# EAGLE design s2kMeterTransposer (EAGLE 6.6.0)
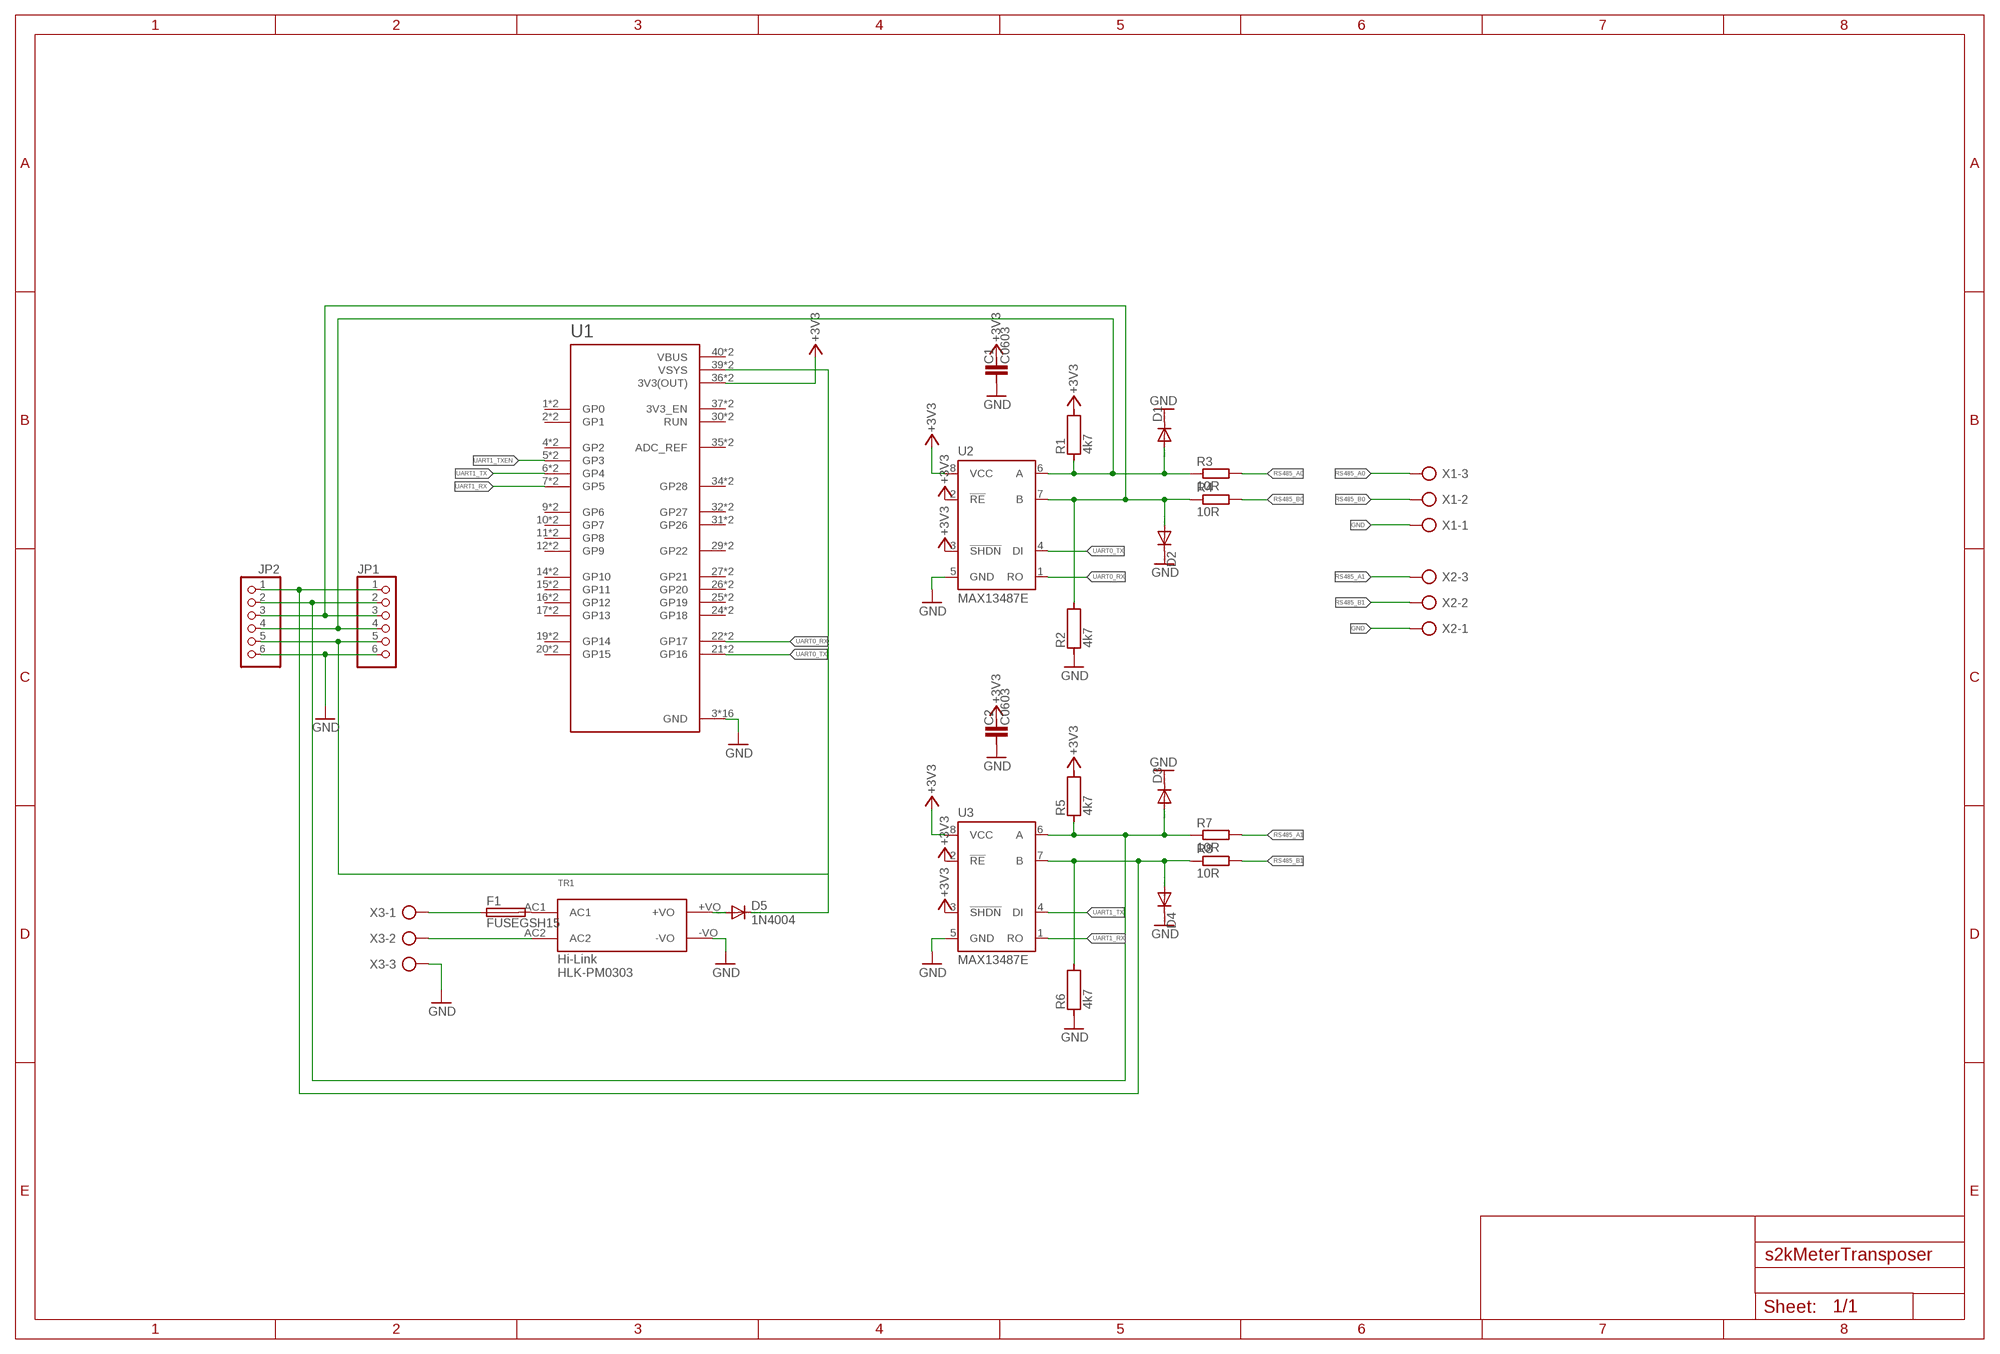
[diagram p0: schematic, sheet 1]

## Parts
C1  C0603  [C0603]
C2  C0603  [C0603]
D1  DIODE-DO-214AC  [DO-214AC]
D2  DIODE-DO-214AC  [DO-214AC]
D3  DIODE-DO-214AC  [DO-214AC]
D4  DIODE-DO-214AC  [DO-214AC]
D5  1N4004  [DO41-10]
F1  FUSEGSH15  [GSH15]
JP1  PINHD-1X6  [1X06]
JP2  PINHD-1X6/90  [1X06/90]
R1  4k7  R0603  [R0603]
R2  4k7  R0603  [R0603]
R3  10R  R-EU_R2010  [R2010]
R4  10R  R-EU_R2010  [R2010]
R5  4k7  R0603  [R0603]
R6  4k7  R0603  [R0603]
R7  10R  R-EU_R2010  [R2010]
R8  10R  R-EU_R2010  [R2010]
TR1  HYX2018013001158  [HYX2018013001158]
U1  RASPBERRY_PICO-NO_DEBUG  [PICO-PKG-NO_DEBUG]
U2  MAX13487E  [SO08]
U3  MAX13487E  [SO08]
X1  AK500/3  [AK500/3]
X2  AK500/3  [AK500/3]
X3  AK500/3  [AK500/3]

## Nets
+3V3: C1.2 C2.2 R1.2 R5.2 U1.36(3V3(OUT)) U1.P$36(3V3(OUT)) U2.2(!RE) U2.3(!SHDN) U2.8(VCC) U3.2(!RE) U3.3(!SHDN) U3.8(VCC)
GND: C1.1 C2.1 D1.C D2.C D3.C D4.C JP1.6 JP2.6 R2.1 R6.1 TR1.-VO U1.3(GND) U1.8(GND) U1.13(GND) U1.18(GND) U1.23(GND) U1.28(GND) U1.33(GND) U1.38(GND) U1.P$3(GND) U1.P$8(GND) U1.P$13(GND) U1.P$18(GND) U1.P$23(GND) U1.P$28(GND) U1.P$33(GND) U1.P$38(GND) U2.5(GND) U3.5(GND) X1.1 X2.1 X3.3
N$1: D2.A JP1.3 JP2.3 R2.2 R4.1 U2.7(B)
N$2: D1.A JP1.4 JP2.4 R1.1 R3.1 U2.6(A)
N$3: D4.A JP1.1 JP2.1 R6.2 R8.1 U3.7(B)
N$4: D3.A JP1.2 JP2.2 R5.1 R7.1 U3.6(A)
N$5: F1.2 TR1.AC1
N$6: F1.1 X3.1
N$7: TR1.AC2 X3.2
N$8: D5.A TR1.+VO
N$9: D5.C JP1.5 JP2.5 U1.39(VSYS) U1.P$39(VSYS)
RS485_A0: R3.2 X1.3
RS485_A1: R7.2 X2.3
RS485_B0: R4.2 X1.2
RS485_B1: R8.2 X2.2
UART0_RX: U1.22(GP17) U1.P$22(GP17) U2.1(RO)
UART0_TX: U1.21(GP16) U1.P$21(GP16) U2.4(DI)
UART1_RX: U1.7(GP5) U1.P$7(GP5) U3.1(RO)
UART1_TX: U1.6(GP4) U1.P$6(GP4) U3.4(DI)
UART1_TXEN: U1.5(GP3) U1.P$5(GP3)
Unconnected: U1.1(GP0) U1.2(GP1) U1.4(GP2) U1.9(GP6) U1.10(GP7) U1.11(GP8) U1.12(GP9) U1.14(GP10) U1.15(GP11) U1.16(GP12) U1.17(GP13) U1.19(GP14) U1.20(GP15) U1.24(GP18) U1.25(GP19) U1.26(GP20) U1.27(GP21) U1.29(GP22) U1.30(RUN) U1.31(GP26) U1.32(GP27) U1.34(GP28) U1.35(ADC_REF) U1.37(3V3_EN) U1.P$1(GP0) U1.P$2(GP1) U1.P$4(GP2) U1.P$9(GP6) U1.P$10(GP7) U1.P$11(GP8) U1.P$12(GP9) U1.P$14(GP10) U1.P$15(GP11) U1.P$16(GP12) U1.P$17(GP13) U1.P$19(GP14) U1.P$20(GP15) U1.P$24(GP18) U1.P$25(GP19) U1.P$26(GP20) U1.P$27(GP21) U1.P$29(GP22) U1.P$30(RUN) U1.P$31(GP26) U1.P$32(GP27) U1.P$34(GP28) U1.P$35(ADC_REF) U1.P$37(3V3_EN)

## Notes on the sheet
- Hi-Link 
  HLK-PM0303

## Power pins joined to a net without a drawn wire
VBUS: U1.40(VBUS) U1.P$40(VBUS)

## Library data of the parts
C1 C2 = KaiLib:C
D1-D4 = diode:DIODE-: DIODE
D5 = diode:1N4004: DIODE general purpose rectifier, 1 A
F1 = fuse:FUSE: Fuse; OC_FARNELL: unknown; OC_NEWARK: unknown
JP1 JP2 = pinhead:PINHD-1X6: PIN HEADER
R1 R2 R5 R6 = KaiLib:R
R3 R4 R7 R8 = rcl:R-EU_: RESISTOR, European symbol
TR1 = KaiLib:HYX2018013001158
U1 = RpiPico:RASPBERRY_PICO-NO_DEBUG
U2 U3 = MAX13487E:MAX13487E: Check availability <https://pricing.snapeda.com/parts/MAX13487E/Maxim%20Integrated/view-part?ref=eda>; AVAILABILITY: In Stock; DESCRIPTION: MAX13487E Digital Cable Driver Interface Evaluation Board; MF: Maxim Integrated; MP: MAX13487E; PACKAGE: SOIC-8 Maxim; PRICE: None; PURCHASE-URL: https://pricing.snapeda.com/search/part/MAX13487E/?ref=eda
X1-X3 = con-ptr500:AK500/3: CONNECTOR; OC_FARNELL: unknown; OC_NEWARK: unknown

## Board
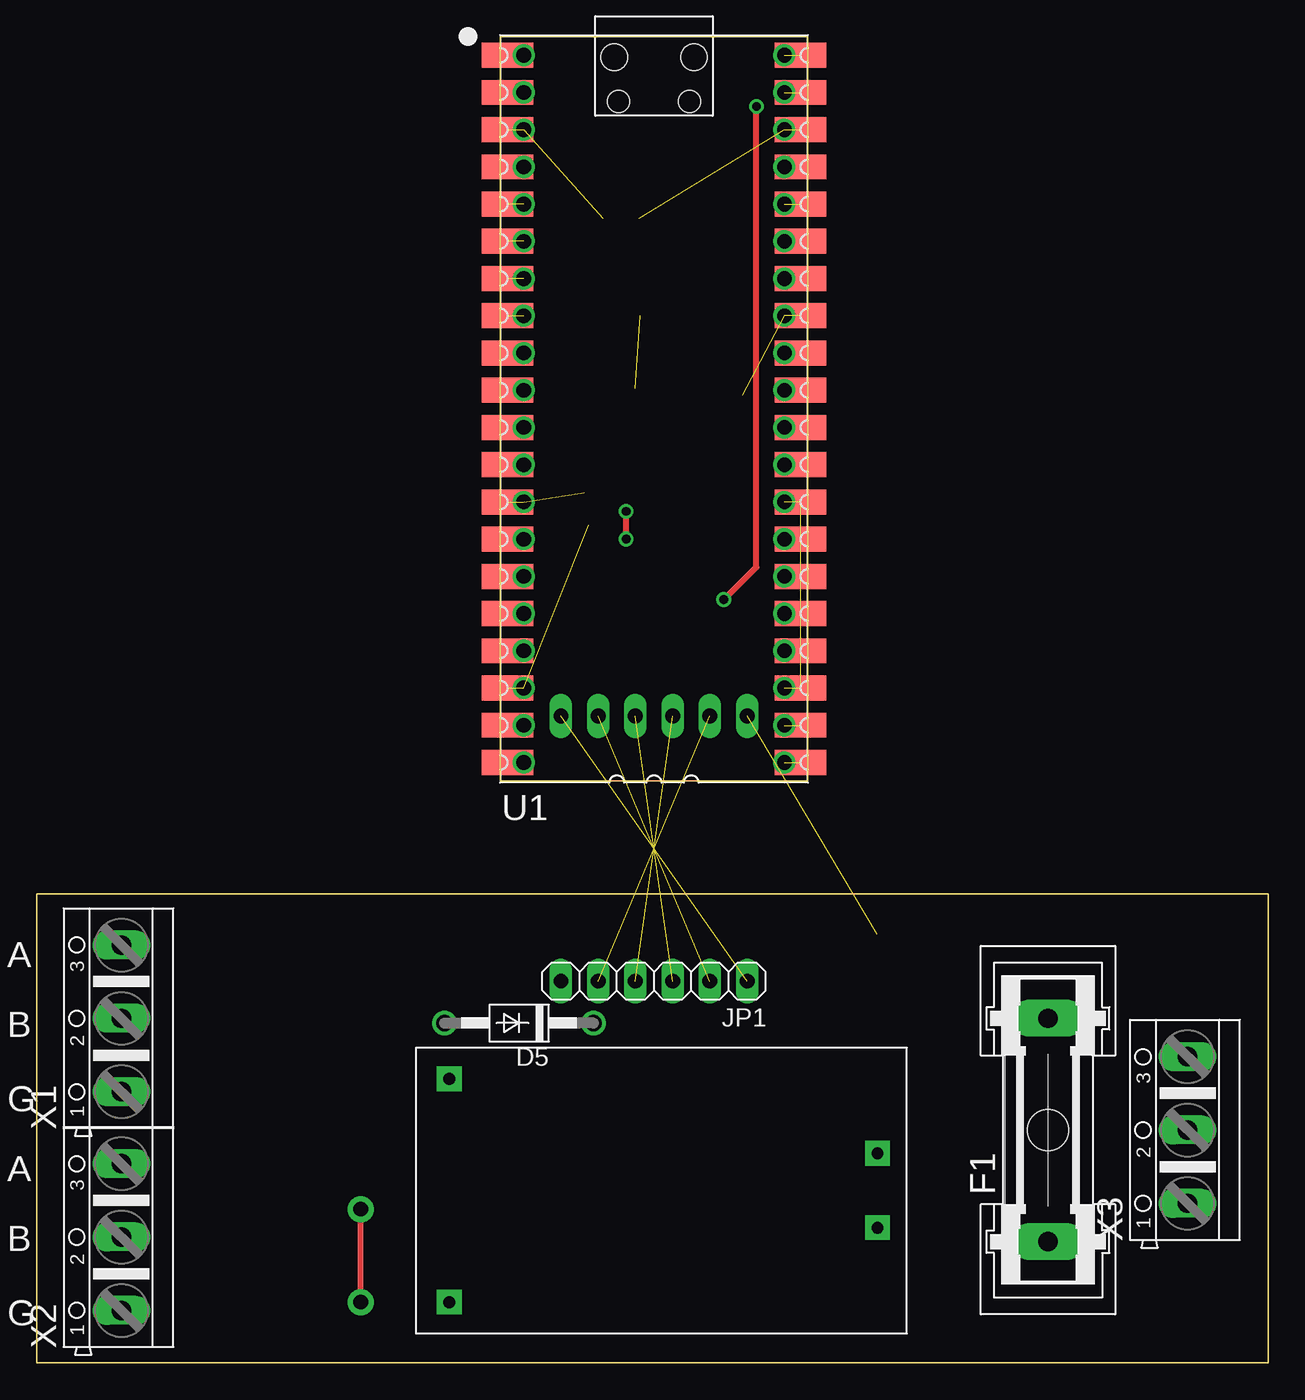
[diagram p1: board, top side]
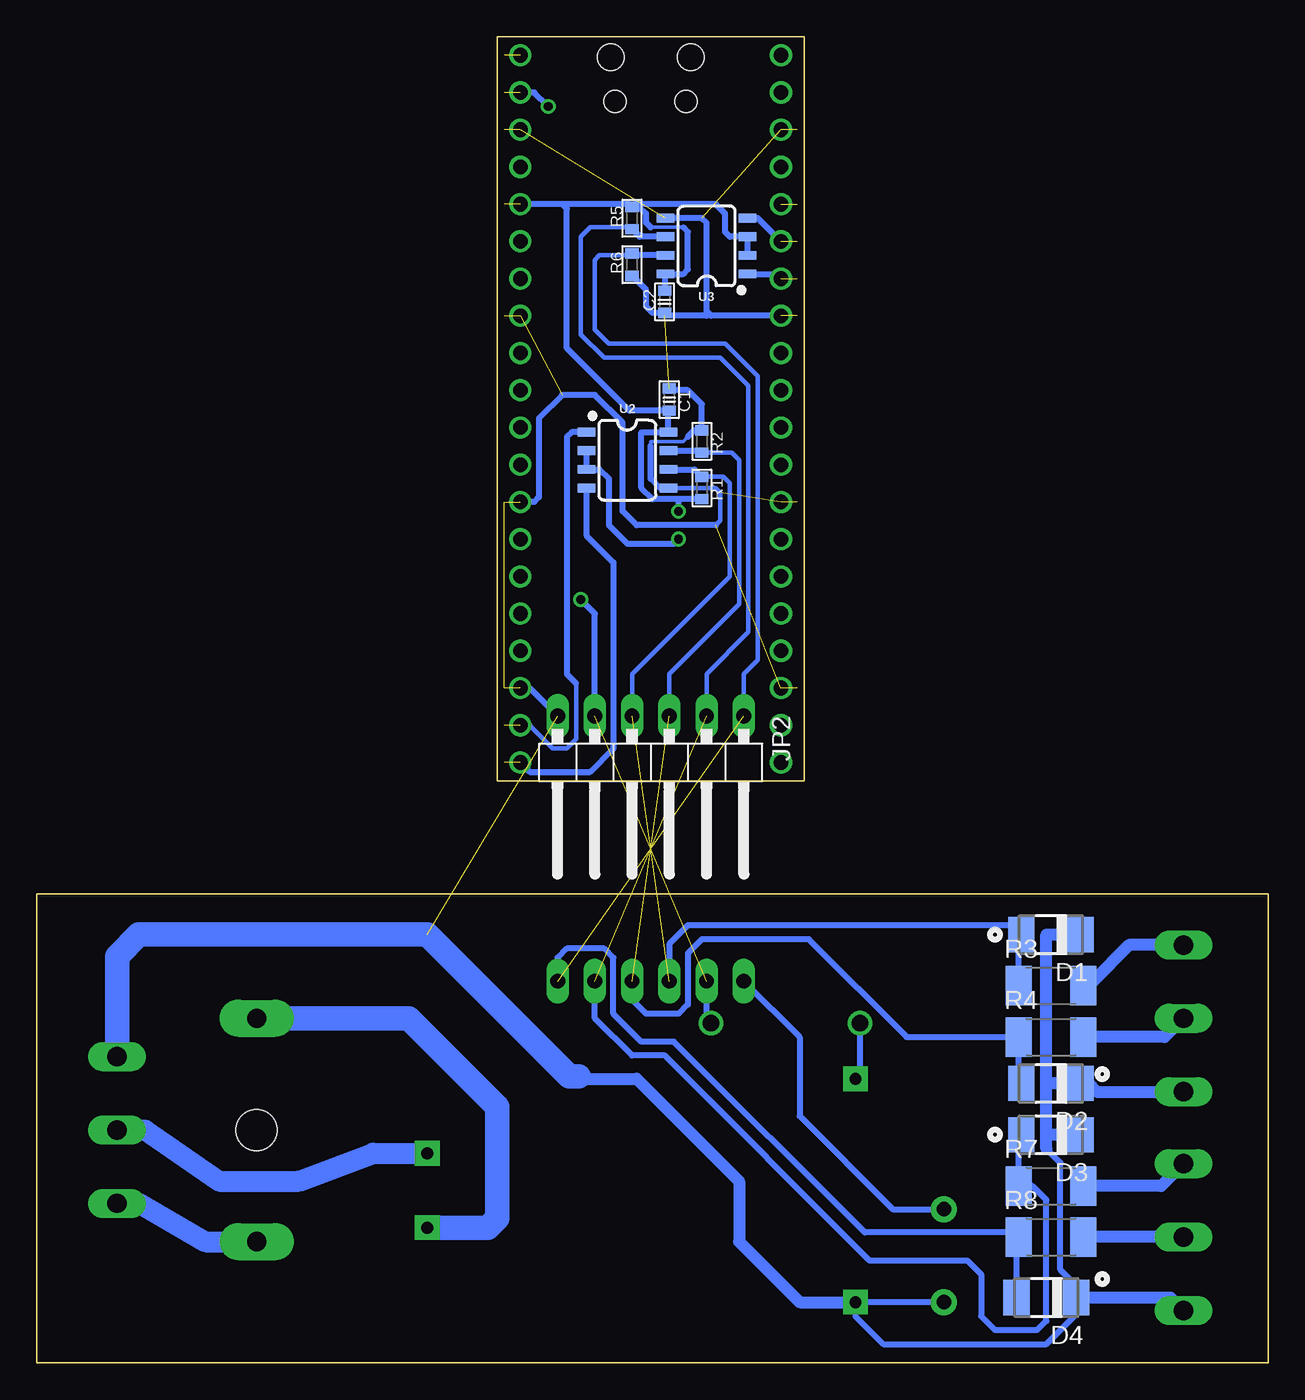
[diagram p2: board, bottom side, seen from below]

Size 84 x 90.5 mm. Coordinates in mm from the lower left corner, seen from the top.
Outline: 0,0 0,32 84,32 84,0 0,0
Outline: 31.64,39.7 52.59,39.7 52.59,90.5 31.64,90.5 31.64,39.7
Copper layers (1*16): Top 0.035mm / dielectric 1.5mm / Bottom 0.035mm
Design rules "default": minimum track width 10mil, minimum drill 24mil, track to track 8mil, track to pad 8mil, pad to pad 8mil, via to via 8mil, smd to smd 8mil, copper to edge 40mil, drill to drill 8mil, minimum pad ring 10mil, minimum via ring 8mil, stop-mask expansion 4mil, vias tented up to drill 0mil, thermal gap 10mil

### Footprints (pad centres in the part's own frame; a part is rotated, then mirrored left to right if it is on the bottom)
C0603 = smd 0.7 x 0.9: 1 -0.762,0; 2 0.762,0
DO-214AC = smd 1.8 x 2.4: A 2.025,0; C -2.025,0
DO41-10 = drill 1.118: A 5.08,0; C -5.08,0
GSH15 = drill 1.321 pad 2.54 long: 1 -7.62,0; 2 7.62,0 | hole 2.794: 0,0
1X06 = drill 1.016 long: 1 -6.35,0; 2 -3.81,0; 3 -1.27,0; 4 1.27,0; 5 3.81,0; 6 6.35,0
1X06/90 = drill 1.016 long: 1 -6.35,-3.81; 2 -3.81,-3.81; 3 -1.27,-3.81; 4 1.27,-3.81; 5 3.81,-3.81; 6 6.35,-3.81
R0603 = smd 0.7 x 0.9: 1 -0.762,0; 2 0.762,0
R2010 = smd 1.8 x 2.7: 1 -2.2,0; 2 2.2,0
HYX2018013001158 = drill 0.8 pad 1.676 square: +VO 13.97,-7.62; -VO 13.97,7.62; AC1 -15.24,2.54; AC2 -15.24,-2.54
PICO-PKG-NO_DEBUG = drill 1: 1 -7.62,25.4; 2 -7.62,22.86; 3 -7.62,20.32; 4 -7.62,17.78; 5 -7.62,15.24; 6 -7.62,12.7; 7 -7.62,10.16; 8 -7.62,7.62; 9 -7.62,5.08; 10 -7.62,2.54; 11 -7.62,0; 12 -7.62,-2.54; 13 -7.62,-5.08; 14 -7.62,-7.62; 15 -7.62,-10.16; 16 -7.62,-12.7; 17 -7.62,-15.24; 18 -7.62,-17.78; 19 -7.62,-20.32; 20 -7.62,-22.86; 21 10.16,-22.86; 22 10.16,-20.32; 23 10.16,-17.78; 24 10.16,-15.24; 25 10.16,-12.7; 26 10.16,-10.16; 27 10.16,-7.62; 28 10.16,-5.08; 29 10.16,-2.54; 30 10.16,0; 31 10.16,2.54; 32 10.16,5.08; 33 10.16,7.62; 34 10.16,10.16; 35 10.16,12.7; 36 10.16,15.24; 37 10.16,17.78; 38 10.16,20.32; 39 10.16,22.86; 40 10.16,25.4 | smd 3.5 x 1.7: P$1 -8.73,25.4; P$2 -8.73,22.86; P$3 -8.73,20.32; P$4 -8.73,17.78; P$5 -8.73,15.24; P$6 -8.73,12.7; P$7 -8.73,10.16; P$8 -8.73,7.62; P$9 -8.73,5.08; P$10 -8.73,2.54; P$11 -8.73,0; P$12 -8.73,-2.54; P$13 -8.73,-5.08; P$14 -8.73,-7.62; P$15 -8.73,-10.16; P$16 -8.73,-12.7; P$17 -8.73,-15.24; P$18 -8.73,-17.78; P$19 -8.73,-20.32; P$20 -8.73,-22.86; P$21 11.27,-22.86; P$22 11.27,-20.32; P$23 11.27,-17.78; P$24 11.27,-15.24; P$25 11.27,-12.7; P$26 11.27,-10.16; P$27 11.27,-7.62; P$28 11.27,-5.08; P$29 11.27,-2.54; P$30 11.27,0; P$31 11.27,2.54; P$32 11.27,5.08; P$33 11.27,7.62; P$34 11.27,10.16; P$35 11.27,12.7; P$36 11.27,15.24; P$37 11.27,17.78; P$38 11.27,20.32; P$39 11.27,22.86; P$40 11.27,25.4 | hole 1.8: -1.455,25.27; 3.995,25.27 | hole 1.5: -1.155,22.24; 3.695,22.24
SO08 = smd 0.6 x 1.2: 1 -1.905,-2.8; 2 -0.635,-2.8; 3 0.635,-2.8; 4 1.905,-2.8; 5 1.905,2.8; 6 0.635,2.8; 7 -0.635,2.8; 8 -1.905,2.8
AK500/3 = drill 1.321 long: 1 -5.004,0; 2 0,0; 3 5.004,0

### Placement (x,y rotation side)
C1  40.84,65.73 270 bottom
C2  41.16,72.4 90 bottom
D1  14.81,29.22 180 bottom
D2  14.81,19.06 180 bottom
D3  14.81,15.57 180 bottom
D4  15.13,4.46 180 bottom
D5  32.91,23.19 180 top
F1  68.99,15.89 90 top
JP1  42.11,26.05 180 top
JP2  42.11,40.34 180 bottom
R1  38.62,59.7 270 bottom
R2  38.62,62.88 270 bottom
R3  14.81,25.73 0 bottom
R4  14.81,22.24 0 bottom
R5  43.38,78.12 90 bottom
R6  43.38,74.94 90 bottom
R7  14.81,12.08 0 bottom
R8  14.81,8.59 0 bottom
TR1  42.11,11.76 180 top
U1  40.84,63.83 0 top
U2  43.7,61.61 270 bottom
U3  38.3,76.21 90 bottom
X1  5.78,23.51 90 top
X2  5.78,8.59 90 top
X3  78.52,15.89 90 top

### Tracks (layer width: path | path; a pad name or v marks a point on that pad's centre or on a via)
+3V3  (via drill 0.6)  (1 unrouted)
  Top 0.406: v40.21,56.21 v40.21,58.11
  Bottom 0.254: 39.89,77.48 42.11,77.48
  Bottom 0.406: 39.89,77.48 39.58,77.16 39.58,74.62 39.89,74.31 U3.8 41.11,73.22 C2.2 | 42.11,77.48 42.43,77.8 42.43,78.44 42.88,78.88 R5.2 | R5.2 43.58,79.07 48.15,79.07 | 48.15,79.07 U1.36 | R1.2 40.21,58.94 | 40.21,58.94 41.99,58.94 42.75,59.7 42.75,63.51 U2.8 40.9,64.92 C1.2 43.58,64.97 47.83,69.23 47.83,78.75 48.15,79.07 | U3.2 U3.3 36.72,76.85 37.03,77.16 37.03,78.44 37.67,79.07 43.19,79.07 R5.2 | U2.2 U2.3 45.61,60.97 44.97,60.34 44.97,57.16 43.7,55.89 40.53,55.89 v40.21,56.21 | v40.21,58.11 40.21,58.94
GND  (via drill 1 pad 1.78)  (16 unrouted)
  Top 0.406: v22.11,4.14 v22.11,10.49
  Bottom 0.254: 42.11,62.56 42.11,62.88 39.89,62.88 39.58,63.2
  Bottom 0.305: 41.48,59.7 37.67,59.7 37.35,59.38 37.35,57.48 37.67,57.16
  Bottom 0.406: U1.8 37.99,71.45 38.3,71.77 | 38.3,71.77 38.3,77.8 38.62,78.12 U3.5 | 38.3,71.77 38.3,71.45 41.16,71.45 C2.1 41.99,71.64 42.43,72.09 42.43,73.23 R6.1 | U2.5 41.48,59.7 42.11,60.34 42.11,62.56 | 39.58,63.2 39.13,63.64 R2.1 38.62,65.42 39.58,66.37 40.72,66.37 C1.1 | 37.67,57.16 43.07,57.16 44.02,58.11 44.02,64.15 45.92,66.05 48.15,66.05 49.73,64.47 49.73,59.07 50.05,58.75 U1.28 | 48.47,20.97 47.04,19.54 46.88,19.38 | 15.13,14.62 14.18,13.66 14.18,6.36 13.1,5.29 D4.C 13.22,4.34 13.22,3.19 15.13,1.28 26.24,1.28 28.14,3.19 TR1.-VO v22.11,4.14 | 14.81,19.06 15.13,18.74 | D2.C 12.27,19.06 | JP1.6 31.95,22.24 31.95,16.84 25.61,10.49 v22.11,10.49 | JP2.6 50.37,46.05 U1.23
  Bottom 0.813: 46.88,19.38 43.07,19.38 36.08,12.39 36.08,8.27 31.95,4.14 TR1.-VO | 15.13,14.62 15.13,15.57 | 15.13,15.57 15.13,18.74 15.13,29.22 D1.C | D2.C 14.81,19.06 | D3.C 15.13,15.57 | 12.27,19.06 11.71,18.5 X1.1 | X2.1 6.65,4.46 D4.C
  Bottom 1.676: X3.3 78.52,27.75 77.04,29.22 57.35,29.22 47.67,19.54 47.04,19.54
N$1  (1 unrouted)
  Bottom 0.305: R2.2 36.59,62.12 36.08,61.61 36.08,51.77 40.84,47 JP2.3
  Bottom 0.406: U2.7 38.75,62.24 R2.2 | D2.A 17.01,19.24 R4.1 24.65,22.24 31.32,28.91 38.62,28.91 39.58,27.95 39.58,24.46 40.21,23.82 42.43,23.82 43.38,24.78 JP1.3
N$2  (1 unrouted)
  Bottom 0.305: R1.1 37.16,60.47 36.72,60.02 36.72,53.67 43.38,47 JP2.4
  Bottom 0.406: U2.6 39.13,60.97 R1.1 | R3.1 17.01,29.05 D1.A 17.47,29.86 39.58,29.86 40.84,28.59 JP1.4
N$3  (1 unrouted)
  Bottom 0.305: U3.7 45.61,75.58 45.92,75.26 45.92,70.5 44.97,69.55 37.03,69.55 34.81,67.32 34.81,47.95 35.77,47 JP2.1
  Bottom 0.406: U3.7 43.26,75.58 R6.2 | D4.A 17.15,8.44 R8.1 17.33,8.9 27.51,8.9 40.53,21.92 42.75,21.92 44.66,23.82 44.66,27.64 45.29,28.27 47.83,28.27 48.47,27.64 JP1.1
N$4  (1 unrouted)
  Bottom 0.305: U3.6 42.75,76.85 43.38,77.48 46.24,77.48 46.88,76.85 46.88,70.18 45.29,68.59 37.35,68.59 35.45,66.69 35.45,49.86 38.3,47 JP2.2
  Bottom 0.406: U3.6 42.88,76.85 R5.1 | D3.A 17.01,15.39 R7.1 16.08,12.08 15.13,11.12 15.13,2.87 15.76,2.23 18.62,2.23 19.57,3.19 19.57,6.05 20.52,7 27.19,7 41.16,20.97 43.38,20.97 45.92,23.51 JP1.2
N$5
  Bottom 1.676: F1.2 58.62,23.51 52.59,17.48 52.59,9.86 53.23,9.22 TR1.AC1
N$6
  Bottom 1.422: X3.1 77,10.88 72.48,8.27 F1.1
N$7
  Bottom 1.422: X3.2 76.61,15.89 71.53,12.39 66.13,12.39 61.05,14.3 TR1.AC2
N$8
  Bottom 0.406: TR1.+VO 27.83,19.7 D5.A
N$9  (via drill 0.6)  (2 unrouted)
  Top 0.406: v46.88,52.08 49.1,54.3 v49.1,85.74
  Bottom 0.406: D5.C 38.3,23.51 JP1.5 | JP2.5 45.92,51.13 v46.88,52.08 | v49.1,85.74 50.05,86.69 U1.39
RS485_A0
  Bottom 0.406: 12,26 R3.2
  Bottom 0.813: X1.3 9.49,28.51 12,26
RS485_A1
  Bottom 0.813: X2.3 7.29,12.08 R7.2
RS485_B0
  Bottom 0.813: X1.2 7.05,22.24 R4.2
RS485_B1
  Bottom 0.813: X2.2 R8.2
UART0_RX  (1 unrouted)
  Bottom 0.305: 47.2,46.37 47.2,42.56 47.83,41.92 48.78,41.92 50.37,43.51
  Bottom 0.406: U2.1 47.51,63.51 47.83,63.2 47.83,47 47.2,46.37 | 50.37,43.51 U1.22
UART0_TX  (1 unrouted)
  Bottom 0.406: U2.4 46.5,56.47 44.66,54.62 44.66,41.92 46.24,40.34 50.37,40.34 U1.21
UART1_RX  (1 unrouted)
  Bottom 0.406: U3.1 33.54,74.31 U1.7
UART1_TX  (1 unrouted)
  Bottom 0.406: U3.4 34.81,78.12 U1.6
UART1_TXEN  (1 unrouted)
VBUS  (1 unrouted)

### Text on the board
tPlace: A | B | SUN2000 | G | A | B | SDM630 | G